# EasyEDA Pro project V2.0.epro, schematic Schematic
Board Name: V2.0; Create Date: 2024-12-31; Page Name: P1; Project Name: 【QuaX】QOpen RP-W5500; Schematic Name: Schematic; Update Date: 2025-03-01; Company: 嘉立创EDA; Drawed: ZRH; Page Size: A3; Version: V1.4
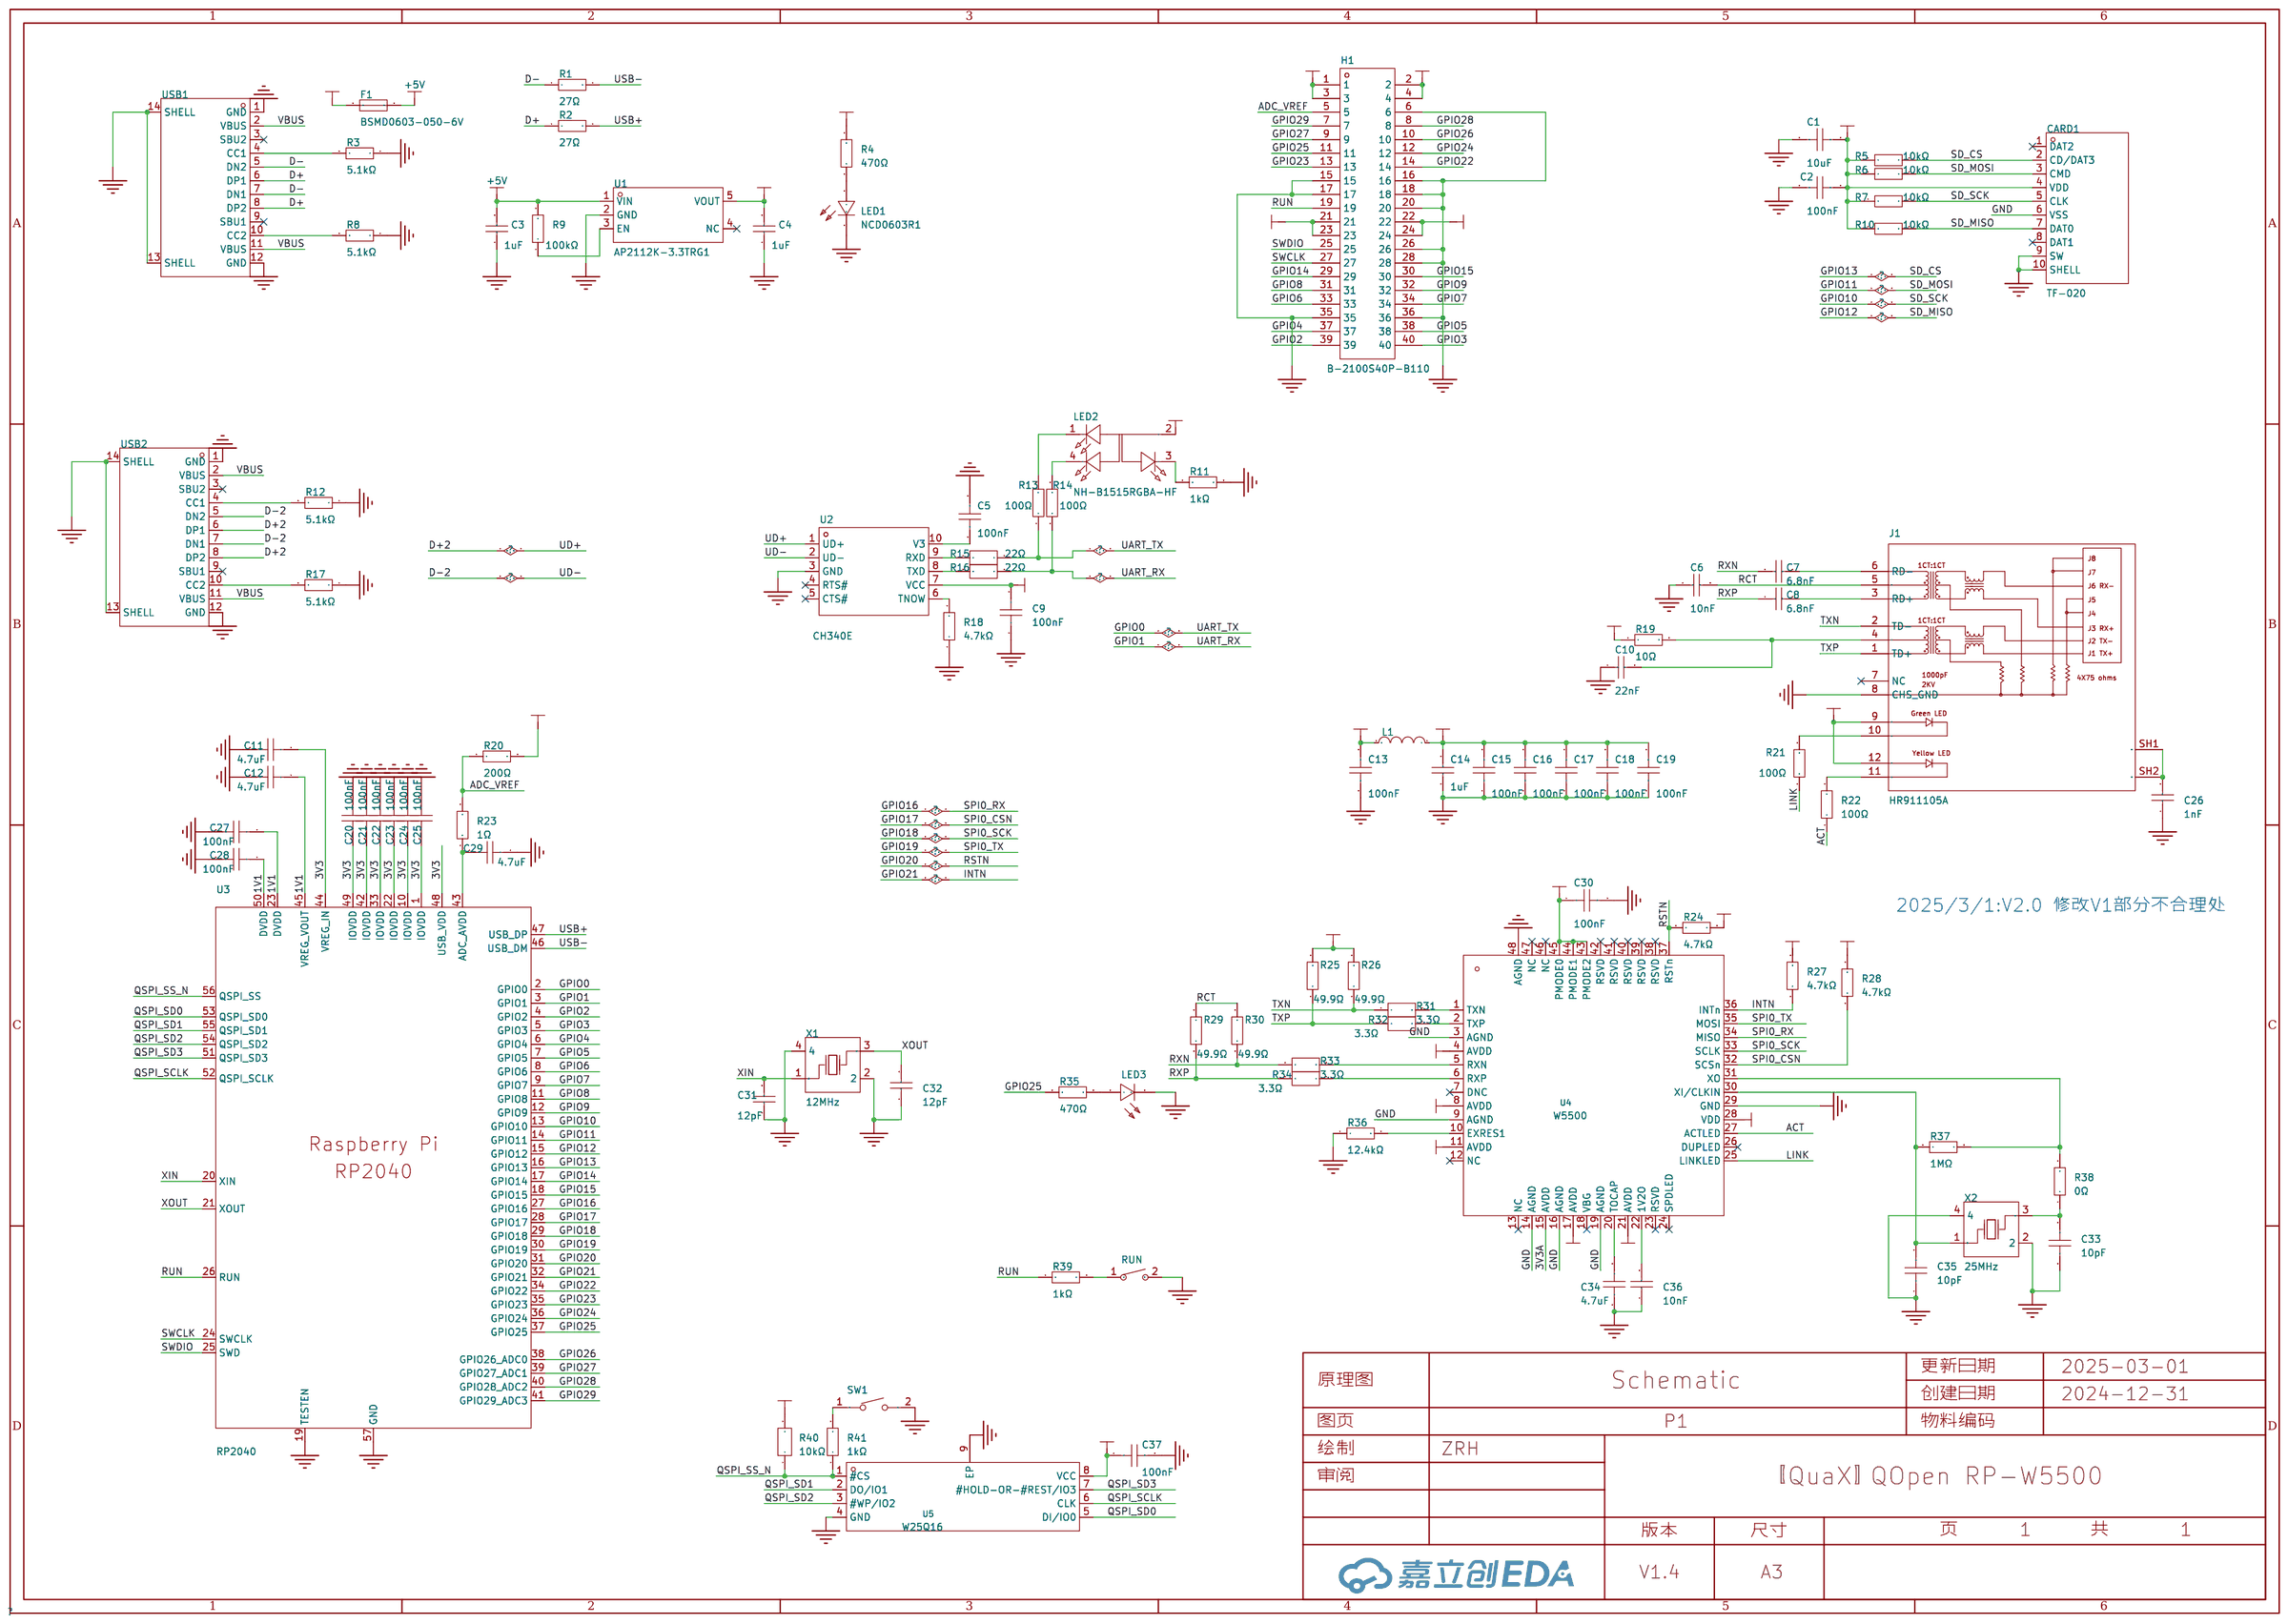
[diagram p0: schematic sheet]

## Parts
C1  10uF  [C0603]
C2  100nF  [C0603]
C3  1uF  [C0603]
C4  1uF  [C0603]
C5  100nF  [C0402]
C6  10nF  [C0402]
C7  6.8nF  [C0402]
C8  6.8nF  [C0402]
C9  100nF  [C0402]
C10  22nF  [C0402]
C11  4.7uF  [C0402]
C12  4.7uF  [C0402]
C13  100nF  [C0402]
C14  1uF  [C0603]
C15  100nF  [C0402]
C16  100nF  [C0402]
C17  100nF  [C0402]
C18  100nF  [C0402]
C19  100nF  [C0402]
C20  100nF  [C0402]
C21  100nF  [C0402]
C22  100nF  [C0402]
C23  100nF  [C0402]
C24  100nF  [C0402]
C25  100nF  [C0402]
C26  1nF  [C1206]
C27  100nF  [C0402]
C28  100nF  [C0402]
C29  4.7uF  [C0402]
C30  100nF  [C0402]
C31  12pF  [C0402]
C32  12pF  [C0402]
C33  10pF  [C0402]
C34  4.7uF  [C0402]
C35  10pF  [C0402]
C36  10nF  [C0402]
C37  100nF  [C0603]
CARD1  TF-020  [TF-SMD_TF-020]
F1  BSMD0603-050-6V  [F0603]
H1  B-2100S40P-B110  [HDR-TH_40P-P2.54-V-M-R2-C20-S2.54]
J1  HR911105A  [RJ45-TH_HR911105A]
L1  BLM18PG121SN1D  [L0603]
LED1  NCD0603R1  [LED0603-RD_RED]
LED2  NH-B1515RGBA-HF  [LED-ARRAY-SMD_4P-L1.6-W1.5-TL_NH-B1515RGBA]
LED3  NCD0603R1  [LED0603-RD_RED]
R1  27Ω  [R0402]
R2  27Ω  [R0402]
R3  5.1kΩ  [R0402]
R4  470Ω  [R0603]
R5  10kΩ  [R0603]
R6  10kΩ  [R0603]
R7  10kΩ  [R0603]
R8  5.1kΩ  [R0402]
R9  100kΩ  [R0603]
R10  10kΩ  [R0603]
R11  1kΩ  [R0402]
R12  5.1kΩ  [R0402]
R13  100Ω  [R0402]
R14  100Ω  [R0402]
R15  22Ω  [R0402]
R16  22Ω  [R0402]
R17  5.1kΩ  [R0402]
R18  4.7kΩ  [R0402]
R19  10Ω  [R0402]
R20  200Ω  [R0603]
R21  100Ω  [R0402]
R22  100Ω  [R0402]
R23  1Ω  [R0402]
R24  4.7kΩ  [R0402]
R25  49.9Ω  [R0402]
R26  49.9Ω  [R0402]
R27  4.7kΩ  [R0402]
R28  4.7kΩ  [R0402]
R29  49.9Ω  [R0402]
R30  49.9Ω  [R0402]
R31  3.3Ω  [R0402]
R32  3.3Ω  [R0402]
R33  3.3Ω  [R0402]
R34  3.3Ω  [R0402]
R35  470Ω  [R0603]
R36  12.4kΩ  [R0402]
R37  1MΩ  [R0402]
R38  0Ω  [R0402]
R39  1kΩ  [R0603]
R40  10kΩ  [R0603]
R41  1kΩ  [R0603]
RUN  TS-1071AD-A1B3-D4  [SW-SMD_L4.0-W3.0-LS4.8]
SW1  TS-1063S-B3D4  [KEY-SMD_L3.0-W2.5-LS4.0_TS-1603S]
U1  AP2112K-3.3TRG1  [SOT-25-5_L2.9-W1.6-P0.95-LS2.8-BL]
U2  CH340E  [MSOP-10_L3.0-W3.0-P0.50-LS5.0-BL]
U3  RP2040  [LQFN-56_L7.0-W7.0-P0.4-EP]
U4  W5500  [LQFP-48_L7.0-W7.0-P0.50-LS9.0-BL]
U5  W25Q16  [WSON-8_L6.0-W5.0-P1.27-BL-EP]
USB1  TYPE-C 16PIN 2MD(073)  [USB-C-SMD_TYPE-C-6PIN-2MD-073]
USB2  TYPE-C 16PIN 2MD(073)  [USB-C-SMD_TYPE-C-6PIN-2MD-073]
X1  12MHz  [OSC-SMD_4P-L2.5-W2.0-BL]
X2  25MHz  [CRYSTAL-SMD_4P-L2.5-W2.0-BL]

## Library data of the parts
C1 = CL10A106KP8NNNC: 容值:10uF;精度:±10%;额定电压:10V;材质(温度系数):X5R;; LCSC Part Name: 10uF ±10% 10V; Supplier Part: C19702; Manufacturer: SAMSUNG(三星); Supplier Footprint: 0603; Datasheet: https://atta.szlcsc.com/upload/public/pdf/source/20160218/1457707763339.pdf; Supplier: LCSC; Tolerance: ±10%; Voltage Rated: 10V; Temperature Coefficient: X5R
C2 C37 = CC0603KRX7R9BB104: 容值:100nF;精度:±10%;额定电压:50V;材质(温度系数):X7R;; LCSC Part Name: 100nF ±10% 50V; Supplier Part: C14663; Manufacturer: YAGEO(国巨); Supplier Footprint: 0603; Datasheet: https://atta.szlcsc.com/upload/public/pdf/source/20180910/C282072_33301C7F631E79921B82A8DAC6BCC5B3.pdf; Supplier: LCSC; Tolerance: ±10%; Voltage Rated: 50V; Temperature Coefficient: X7R
C3 C4 = CL10A105KB8NNNC: 容值:1uF;精度:±10%;额定电压:50V;材质(温度系数):X5R;; LCSC Part Name: 1uF ±10% 50V; Supplier Part: C15849; Manufacturer: SAMSUNG(三星); Supplier Footprint: 0603; Datasheet: https://atta.szlcsc.com/upload/public/pdf/source/20160218/1457707763339.pdf; Supplier: LCSC; Tolerance: ±10%; Voltage Rated: 50V; Temperature Coefficient: X5R
C5 C9 C13 C15-C19 C30 = CL05B104KB54PNC: 容值:100nF;精度:±10%;额定电压:50V;材质(温度系数):X7R;; LCSC Part Name: 100nF ±10% 50V; Supplier Part: C307331; Manufacturer: SAMSUNG(三星); Supplier Footprint: 0402; Datasheet: https://atta.szlcsc.com/upload/public/pdf/source/20181009/C307331_222F7C870FD3EA5F46F538B483443886.pdf; Supplier: LCSC; Tolerance: ±10%; Voltage Rated: 50V; Temperature Coefficient: X7R
C6 C36 = CC0402KRX7R9BB103: 容值:10nF;精度:±10%;额定电压:50V;材质(温度系数):X7R;; LCSC Part Name: 10nF ±10% 50V; Supplier Part: C60133; Manufacturer: YAGEO(国巨); Supplier Footprint: 0402; Datasheet: https://atta.szlcsc.com/upload/public/pdf/source/20180224/C181747_15194369449651363981.pdf; Supplier: LCSC; Tolerance: ±10%; Voltage Rated: 50V; Temperature Coefficient: X7R
C7 C8 = CC0402KRX7R9BB682: 容值:6.8nF;精度:±10%;额定电压:50V;材质(温度系数):X7R;; LCSC Part Name: 6.8nF ±10% 50V; Supplier Part: C93654; Manufacturer: YAGEO(国巨); Supplier Footprint: 0402; Datasheet: https://atta.szlcsc.com/upload/public/pdf/source/20181008/C309510_22F155564471FAF6A489F7D68F34234E.pdf; Supplier: LCSC; Tolerance: ±10%; Voltage Rated: 50V; Temperature Coefficient: X7R
C10 = CC0402KRX7R9BB223: 容值:22nF;精度:±10%;额定电压:50V;材质(温度系数):X7R;; LCSC Part Name: 22nF ±10% 50V; Supplier Part: C107026; Manufacturer: YAGEO(国巨); Supplier Footprint: 0402; Datasheet: https://atta.szlcsc.com/upload/public/pdf/source/20170914/C128857_1505359892143968080.pdf; Supplier: LCSC; Tolerance: ±10%; Voltage Rated: 50V; Temperature Coefficient: X7R
C11 C12 C29 = CL05A475KP5NRNC: 容值:4.7uF;精度:±10%;额定电压:10V;材质(温度系数):X5R;; LCSC Part Name: 4.7uF ±10% 10V; Supplier Part: C368809; Manufacturer: SAMSUNG(三星); Supplier Footprint: 0402; Datasheet: https://atta.szlcsc.com/upload/public/pdf/source/20160218/1457707763339.pdf; Supplier: LCSC; Tolerance: ±10%; Voltage Rated: 10V; Temperature Coefficient: X5R
C14 = 0603B105K250NT: 容值:1uF;精度:±10%;额定电压:25V;材质(温度系数):X7R;; LCSC Part Name: 1uF ±10% 25V; Supplier Part: C59302; Manufacturer: FH(风华); Supplier Footprint: 0603; Datasheet: https://atta.szlcsc.com/upload/public/pdf/source/20200305/C486355_26A10D38EF8C2A5C37091D0039909270.pdf; Supplier: LCSC; Tolerance: ±10%; Voltage Rated: 25V; Temperature Coefficient: X7R
C20-C25 C27 C28 = CC0402KRX7R7BB104: 容值:100nF;精度:±10%;额定电压:16V;材质(温度系数):X7R;; LCSC Part Name: 100nF ±10% 16V; Supplier Part: C60474; Manufacturer: YAGEO(国巨); Supplier Footprint: 0402; Datasheet: https://atta.szlcsc.com/upload/public/pdf/source/20211223/9278FD768280B81DDBEF48FA36411A03.pdf; Supplier: LCSC; Tolerance: ±10%; Voltage Rated: 16V; Temperature Coefficient: X7R
C26 = 1206B102K202NT: 容值:1nF;精度:±10%;额定电压:2kV;材质(温度系数):X7R;; LCSC Part Name: 1nF ±10% 2kV; Supplier Part: C9196; Manufacturer: FH(风华); Supplier Footprint: 1206; Datasheet: https://atta.szlcsc.com/upload/public/pdf/source/20200305/C486355_26A10D38EF8C2A5C37091D0039909270.pdf; Supplier: LCSC; Tolerance: ±10%; Voltage Rated: 2kV; Temperature Coefficient: X7R
C31 C32 = 0402CG120J500NT: 容值:12pF;精度:±5%;额定电压:50V;材质(温度系数):C0G;; LCSC Part Name: 12pF ±5% 50V; Supplier Part: C1547; Manufacturer: FH(风华); Supplier Footprint: 0402; Datasheet: https://atta.szlcsc.com/upload/public/pdf/source/20200305/C486355_26A10D38EF8C2A5C37091D0039909270.pdf; Supplier: LCSC; Tolerance: ±5%; Voltage Rated: 50V; Temperature Coefficient: C0G
C33 C35 = CL05C100JB5NNNC: 容值:10pF;精度:±5%;额定电压:50V;材质(温度系数):C0G;; LCSC Part Name: 10pF ±5% 50V; Supplier Part: C32949; Manufacturer: SAMSUNG(三星); Supplier Footprint: 0402; JLCPCB Part Class: 基础库; Datasheet: https://atta.szlcsc.com/upload/public/pdf/source/20160218/1457707763339.pdf; Supplier: LCSC; Tolerance: ±5%; Voltage Rated: 50V; Temperature Coefficient: C0G
C34 = GRM155R61E475ME15D: 容值:4.7uF;额定电压:25V;材质(温度系数):X5R;; LCSC Part Name: 4.7uF 25V; Supplier Part: C2858031; Manufacturer: muRata(村田); Supplier Footprint: 0402; Datasheet: https://atta.szlcsc.com/upload/public/pdf/source/20170523/1495533985505.pdf; Supplier: LCSC; Voltage Rated: 25V; Temperature Coefficient: X5R
CARD1 = TF-020: 卡连接方式:拔插式;卡类型:MicroSD卡(TF卡);连接器类型:卡座;本体最大高度:1.32mm;触头镀层:镀金;工作温度范围:-45℃~+85℃;; LCSC Part Name: 拔插式 MicroSD卡(TF卡) 卡座; Supplier Part: C961681; Manufacturer: HANBO(汉博); Supplier Footprint: SMD; JLCPCB Part Class: 扩展库; Datasheet: https://atta.szlcsc.com/upload/public/pdf/source/20221111/8B0ADC00F0C3F54A097DF36EFC4442FF.pdf; Supplier: LCSC; Card Connection Mode: 拔插式; Card Type: MicroSD卡(TF卡); Connector Type: 卡座; Maximum Body Height: 1.32mm; Contact Plating: 镀金; Operating Temperature Range: -45℃~+85℃
F1 = BSMD0603-050-6V: 最大电压:6V;最大电流:40A;保持电流:500mA;跳闸电流:1A;; LCSC Part Name: 6V 500mA 0603自恢复; Supplier Part: C883095; Manufacturer: BHFUSE(佰宏); Supplier Footprint: 0603; Datasheet: https://atta.szlcsc.com/upload/public/pdf/source/20230512/E478DE3555A0061DA0124A9F45802B86.pdf; Supplier: LCSC; Operating Voltage (Max): 6V; Current Rating (Max): 40A; Hold Current: 500mA; Trip Current: 1A; Power Dissipation: 500mW; Resistance - Initial (Ri) (Min): 100mΩ; Resistance - Post Trip (R1) (Max): 800mΩ; Maximum Time to Trip: 100ms; Operating Temperature: -40℃~+85℃
H1 = B-2100S40P-B110: 插针结构:2x20P;间距:2.54mm;行距:2.54mm;圆针/方针:-;安装类型:直插;排数:双排;总PIN位数:40P;额定电流:-;额定电压:-;配合针长度:6mm;塑高:2.54mm;端接针长度:3mm;触头材质:黄铜;触头镀层:-;工作温度范围:-40℃~+105℃;颜色:黑色;; LCSC Part Name: 间距:2.54mm 2x20P 直插; Supplier Part: C124383; Manufacturer: Ckmtw(灿科盟); Supplier Footprint: 插件,P=2.54mm; JLCPCB Part Class: 扩展库; Datasheet: https://atta.szlcsc.com/upload/public/pdf/source/20180130/C169817_15172974075481323419.pdf; Supplier: LCSC; Pin Structure: 2x20P; Pitch: 2.54mm; Row Spacing: 2.54mm; Mounting Type: 直插; Number of Rows: 双排; Number of Pins: 40P; Length of Mating Pin: 6mm; Insulation Height: 2.54mm; Length of End Connection Pin: 3mm; Contact Material: 黄铜; Operating Temperature Range: -40℃~+105℃; Color: 黑色
J1 = HR911105A_C12074: 连接器类型:RJ插座;USOC代码:RJ45;端口数量:1;屏蔽:-;LED:带LED;等级:-;; LCSC Part Name: RJ45 带LED; Supplier Part: C12074; Manufacturer: HANRUN(汉仁); Supplier Footprint: 插件; Datasheet: https://atta.szlcsc.com/upload/public/pdf/source/20170918/C12074_1505726819496976146.pdf; Supplier: LCSC; Connector Type: RJ插座; USOC Codes: RJ45; Number of Ports: 1; LED: 带LED
L1 = BLM18PG121SN1D: 标称阻抗@测试频率:120Ω@100MHz;误差:±25%;直流电阻(RDC):50mΩ;; LCSC Part Name: 单路 0603磁珠 阻抗120Ω@100MHz; Supplier Part: C14709; Manufacturer: muRata(村田); Supplier Footprint: 0603; JLCPCB Part Class: 扩展库; Datasheet: https://atta.szlcsc.com/upload/public/pdf/source/20130704/1457706621422.pdf; Supplier: LCSC; Impedance @ Frequency: 120Ω@100MHz; Tolerance: ±25%; DC Resistance: 50mΩ; Current Rating: 2A; Circuits: 1
LED1 LED3 = NCD0603R1_C84263: 灯头类型:-;发光颜色:红色;正向电压(VF):1.6V~2.6V;功率:65mW;正向电流:20mA;主波长:615nm~630nm;二极管配置:独立二极管;透镜颜色:无色透明透镜;色温:-;发光强度:80mcd~220mcd;发光角度:130°;载带方式:-;工作温度:-30℃~+85℃;; Supplier Part: C84263; Manufacturer: 国星光电; Supplier Footprint: 0603; Datasheet: https://atta.szlcsc.com/upload/public/pdf/source/20200820/C84263_DABC6A75E58F576973B407FDBA283D60.pdf; Supplier: LCSC; Emitted Color: 红色; Forward Voltage (VF): 1.6V~2.6V; Power Dissipation: 65mW; Forward Current: 20mA; Dominant Wavelength: 615nm~630nm; Diode Configuration: 独立二极管; Lens Color: 无色透明透镜; Luminous Intensity: 80mcd~220mcd; Viewing Angle: 130°; Operating Temperature: -30℃~+85℃
LED2 = NH-B1515RGBA-HF: 发光颜色:RGB三色;正向电压(VF):2.7V；2V；2.8V;功率:64mW；48mW;正向电流:3mA；8mA；5mA;主波长:470nm；526nm；622nm;二极管配置:共阳极;透镜颜色:-;色温:-;发光强度:155mcd；25mcd；48mcd;发光角度:110°;载带方式:-;工作温度:-30℃~+85℃;; Supplier Part: C2874115; Manufacturer: 国星光电; Supplier Footprint: 0606; Datasheet: https://atta.szlcsc.com/upload/public/pdf/source/20210810/0C11C8EE97F43D8CD153FEF2CA3E0D70.pdf; Supplier: LCSC; Emitted Color: RGB三色; Forward Voltage (VF): 2.7V；2V；2.8V; Power Dissipation: 64mW；48mW; Forward Current: 3mA；8mA；5mA; Dominant Wavelength: 470nm；526nm；622nm; Diode Configuration: 共阳极; Luminous Intensity: 155mcd；25mcd；48mcd; Viewing Angle: 110°; Operating Temperature: -30℃~+85℃
R1 R2 = RC0402FR-0727RL: 电阻类型:厚膜电阻;阻值:27Ω;精度:±1%;功率:62.5mW;最大工作电压:50V;温度系数:±100ppm/℃;; LCSC Part Name: 厚膜电阻 27Ω ±1% 62.5mW; Supplier Part: C138021; Manufacturer: YAGEO(国巨); Supplier Footprint: 0402; JLCPCB Part Class: 扩展库; Datasheet: https://atta.szlcsc.com/upload/public/pdf/source/20181009/C309620_DA5935B6E1D48212CB7A533FE518B3C2.pdf; Supplier: LCSC; Type: 厚膜电阻; Tolerance: ±1%; Power(Watts): 62.5mW; Overload Voltage (Max): 50V; Temperature Coefficient: ±100ppm/℃; Operating Temperature Range: -55℃~+155℃
R3 R8 R12 R17 = 0402WGF5101TCE: 电阻类型:厚膜电阻;阻值:5.1kΩ;精度:±1%;功率:62.5mW;最大工作电压:50V;温度系数:±100ppm/℃;; LCSC Part Name: 5.1kΩ ±1% 62.5mW 厚膜电阻; Supplier Part: C25905; Manufacturer: UNI-ROYAL(厚声); Supplier Footprint: 0402; Datasheet: https://atta.szlcsc.com/upload/public/pdf/source/20200306/C422600_1E6D84923E4A46A82E41ADD87F860B5C.pdf; Supplier: LCSC; Type: 厚膜电阻; Tolerance: ±1%; Power(Watts): 62.5mW; Overload Voltage (Max): 50V; Temperature Coefficient: ±100ppm/℃; Operating Temperature Range: -55℃~+155℃
R4 = 0603WAF4700T5E: 电阻类型:厚膜电阻;阻值:470Ω;精度:±1%;功率:100mW;最大工作电压:75V;温度系数:±100ppm/℃;; LCSC Part Name: 470Ω ±1% 100mW 厚膜电阻; Supplier Part: C23179; Manufacturer: UNI-ROYAL(厚声); Supplier Footprint: 0603; Datasheet: https://atta.szlcsc.com/upload/public/pdf/source/20200306/C422600_1E6D84923E4A46A82E41ADD87F860B5C.pdf; Supplier: LCSC; Type: 厚膜电阻; Tolerance: ±1%; Power(Watts): 100mW; Overload Voltage (Max): 75V; Temperature Coefficient: ±100ppm/℃; Operating Temperature Range: -55℃~+155℃
R5-R7 R10 = 0603WAF1002T5E: 电阻类型:厚膜电阻;阻值:10kΩ;精度:±1%;功率:100mW;最大工作电压:75V;温度系数:±100ppm/℃;; LCSC Part Name: 厚膜电阻 10kΩ ±1% 100mW; Supplier Part: C25804; Manufacturer: UNI-ROYAL(厚声); Supplier Footprint: 0603; Datasheet: https://atta.szlcsc.com/upload/public/pdf/source/20200306/C422600_1E6D84923E4A46A82E41ADD87F860B5C.pdf; Supplier: LCSC; Type: 厚膜电阻; Tolerance: ±1%; Power(Watts): 100mW; Overload Voltage (Max): 75V; Temperature Coefficient: ±100ppm/℃; Operating Temperature Range: -55℃~+155℃
R9 = RC0603FR-07100KL: 电阻类型:厚膜电阻;阻值:100kΩ;精度:±1%;功率:100mW;最大工作电压:75V;温度系数:±100ppm/℃;; LCSC Part Name: 厚膜电阻 100kΩ ±1% 100mW; Supplier Part: C14675; Manufacturer: YAGEO(国巨); Supplier Footprint: 0603; Datasheet: https://atta.szlcsc.com/upload/public/pdf/source/20140324/1457707028752.pdf; Supplier: LCSC; Type: 厚膜电阻; Tolerance: ±1%; Power(Watts): 100mW; Overload Voltage (Max): 75V; Temperature Coefficient: ±100ppm/℃; Operating Temperature Range: -55℃~+155℃
R11 = ERJ2RKF1001X: 阻值:1kΩ;精度:±1%;功率:100mW;温度系数:±100ppm/℃;电阻类型:厚膜电阻;; LCSC Part Name: 1kΩ ±1% 100mW 厚膜电阻; Supplier Part: C242161; Manufacturer: PANASONIC(松下); Supplier Footprint: 0402; Datasheet: https://atta.szlcsc.com/upload/public/pdf/source/20181106/C242161_4F5F550A2C91B7234698FE1AE4119762.pdf; Supplier: LCSC; Tolerance: ±1%; Power(Watts): 100mW; Temperature Coefficient: ±100ppm/℃; Type: 厚膜电阻; Operating Temperature Range: -55℃~+155℃
R13 R14 = RC0402FR-07100RL: 电阻类型:厚膜电阻;阻值:100Ω;精度:±1%;功率:62.5mW;; LCSC Part Name: 100Ω ±1% 62.5mW; Supplier Part: C106232; Manufacturer: YAGEO(国巨); Supplier Footprint: 0402; Datasheet: https://atta.szlcsc.com/upload/public/pdf/source/20170518/1495085712869.pdf; Supplier: LCSC; Type: 厚膜电阻; Tolerance: ±1%; Power(Watts): 62.5mW; Temperature Coefficient: ±100ppm/℃; Overload Voltage (Max): 50V; Operating Temperature Range: -55℃~+155℃
R15 R16 = ERJ2RKF22R0X: 阻值:22Ω;精度:±1%;功率:100mW;温度系数:±100ppm/℃;电阻类型:厚膜电阻;; LCSC Part Name: 22Ω ±1% 100mW 厚膜电阻; Supplier Part: C413049; Manufacturer: PANASONIC(松下); Supplier Footprint: 0402; Datasheet: https://atta.szlcsc.com/upload/public/pdf/source/20190820/C413049_961C628CF7B0DFFBC596BB178EBFA00C.pdf; Supplier: LCSC; Tolerance: ±1%; Power(Watts): 100mW; Temperature Coefficient: ±100ppm/℃; Type: 厚膜电阻; Operating Temperature Range: -55℃~+155℃
R18 R24 R27 R28 = 0402WGF4701TCE: 阻值:4.7kΩ;精度:±1%;功率:62.5mW;温度系数:±100ppm/℃;电阻类型:厚膜电阻;; LCSC Part Name: 4.7kΩ ±1% 62.5mW 厚膜电阻; Supplier Part: C25900; Manufacturer: UNI-ROYAL(厚声); Supplier Footprint: 0402; Datasheet: https://atta.szlcsc.com/upload/public/pdf/source/20200306/C422600_1E6D84923E4A46A82E41ADD87F860B5C.pdf; Supplier: LCSC; Tolerance: ±1%; Power(Watts): 62.5mW; Overload Voltage (Max): 50V; Temperature Coefficient: ±100ppm/℃; Type: 厚膜电阻; Operating Temperature Range: -55℃~+155℃
R19 = 0402WGF100JTCE: 电阻类型:厚膜电阻;阻值:10Ω;精度:±1%;功率:62.5mW;最大工作电压:50V;温度系数:±200ppm/℃;; LCSC Part Name: 10Ω ±1% 62.5mW 厚膜电阻; Supplier Part: C25077; Manufacturer: UNI-ROYAL(厚声); Supplier Footprint: 0402; Datasheet: https://atta.szlcsc.com/upload/public/pdf/source/20200306/C422600_1E6D84923E4A46A82E41ADD87F860B5C.pdf; Supplier: LCSC; Type: 厚膜电阻; Tolerance: ±1%; Power(Watts): 62.5mW; Overload Voltage (Max): 50V; Temperature Coefficient: ±200ppm/℃; Operating Temperature Range: -55℃~+155℃
R20 = 0603WAF2000T5E: 电阻类型:厚膜电阻;阻值:200Ω;精度:±1%;功率:100mW;最大工作电压:75V;温度系数:±100ppm/℃;; LCSC Part Name: 200Ω ±1% 100mW 厚膜电阻; Supplier Part: C8218; Manufacturer: UNI-ROYAL(厚声); Supplier Footprint: 0603; Datasheet: https://atta.szlcsc.com/upload/public/pdf/source/20200306/C422600_1E6D84923E4A46A82E41ADD87F860B5C.pdf; Supplier: LCSC; Type: 厚膜电阻; Tolerance: ±1%; Power(Watts): 100mW; Overload Voltage (Max): 75V; Temperature Coefficient: ±100ppm/℃; Operating Temperature Range: -55℃~+155℃
R21 R22 = 0402WGF1000TCE: 电阻类型:厚膜电阻;阻值:100Ω;精度:±1%;功率:62.5mW;最大工作电压:50V;温度系数:±200ppm/℃;; LCSC Part Name: 100Ω ±1% 62.5mW 厚膜电阻; Supplier Part: C25076; Manufacturer: UNI-ROYAL(厚声); Supplier Footprint: 0402; Datasheet: https://atta.szlcsc.com/upload/public/pdf/source/20200306/C422600_1E6D84923E4A46A82E41ADD87F860B5C.pdf; Supplier: LCSC; Type: 厚膜电阻; Tolerance: ±1%; Power(Watts): 62.5mW; Overload Voltage (Max): 50V; Temperature Coefficient: ±200ppm/℃; Operating Temperature Range: -55℃~+155℃
R23 = 0402WGF100KTCE: 电阻类型:厚膜电阻;阻值:1Ω;精度:±1%;功率:62.5mW;最大工作电压:50V;温度系数:±200ppm/℃;; LCSC Part Name: 1Ω ±1% 62.5mW 厚膜电阻; Supplier Part: C25086; Manufacturer: UNI-ROYAL(厚声); Supplier Footprint: 0402; Datasheet: https://atta.szlcsc.com/upload/public/pdf/source/20200306/C422600_1E6D84923E4A46A82E41ADD87F860B5C.pdf; Supplier: LCSC; Type: 厚膜电阻; Tolerance: ±1%; Power(Watts): 62.5mW; Overload Voltage (Max): 50V; Temperature Coefficient: ±200ppm/℃; Operating Temperature Range: -55℃~+155℃
R25 R26 R29 R30 = 0402WGF499JTCE: 电阻类型:厚膜电阻;阻值:49.9Ω;精度:±1%;功率:62.5mW;最大工作电压:50V;温度系数:±100ppm/℃;; LCSC Part Name: 49.9Ω ±1% 62.5mW 厚膜电阻; Supplier Part: C25120; Manufacturer: UNI-ROYAL(厚声); Supplier Footprint: 0402; JLCPCB Part Class: 基础库; Datasheet: https://atta.szlcsc.com/upload/public/pdf/source/20200306/C422600_1E6D84923E4A46A82E41ADD87F860B5C.pdf; Supplier: LCSC; Type: 厚膜电阻; Tolerance: ±1%; Power(Watts): 62.5mW; Overload Voltage (Max): 50V; Temperature Coefficient: ±100ppm/℃; Operating Temperature Range: -55℃~+155℃
R31-R34 = FRC0402F3R30TS: 电阻类型:厚膜电阻;阻值:3.3Ω;精度:±1%;功率:62.5mW;最大工作电压:50V;温度系数:±200ppm/℃;; LCSC Part Name: 3.3Ω ±1% 62.5mW 厚膜电阻; Supplier Part: C2933094; Manufacturer: FOJAN(富捷); Supplier Footprint: 0402; Datasheet: https://atta.szlcsc.com/upload/public/pdf/source/20211221/925EC7D7225764EE0046F22065062C87.pdf; Supplier: LCSC; Type: 厚膜电阻; Tolerance: ±1%; Power(Watts): 62.5mW; Overload Voltage (Max): 50V; Temperature Coefficient: ±200ppm/℃; Operating Temperature Range: -55℃~+155℃
R35 = 0603WAF1501T5E: 电阻类型:厚膜电阻;阻值:1.5kΩ;精度:±1%;功率:100mW;最大工作电压:75V;温度系数:±100ppm/℃;; LCSC Part Name: 1.5kΩ ±1% 100mW 厚膜电阻; Supplier Part: C22843; Manufacturer: UNI-ROYAL(厚声); Supplier Footprint: 0603; Datasheet: https://atta.szlcsc.com/upload/public/pdf/source/20200306/C422600_1E6D84923E4A46A82E41ADD87F860B5C.pdf; Supplier: LCSC; Type: 厚膜电阻; Tolerance: ±1%; Power(Watts): 100mW; Overload Voltage (Max): 75V; Temperature Coefficient: ±100ppm/℃; Operating Temperature Range: -55℃~+155℃
R36 = 0402WGF1242TCE: 电阻类型:厚膜电阻;阻值:12.4kΩ;精度:±1%;功率:62.5mW;最大工作电压:50V;温度系数:±100ppm/℃;; LCSC Part Name: 12.4kΩ ±1% 62.5mW 厚膜电阻; Supplier Part: C11692; Manufacturer: UNI-ROYAL(厚声); Supplier Footprint: 0402; Datasheet: https://atta.szlcsc.com/upload/public/pdf/source/20200306/C422600_1E6D84923E4A46A82E41ADD87F860B5C.pdf; Supplier: LCSC; Type: 厚膜电阻; Tolerance: ±1%; Power(Watts): 62.5mW; Overload Voltage (Max): 50V; Temperature Coefficient: ±100ppm/℃; Operating Temperature Range: -55℃~+155℃
R37 = 0402WGF1004TCE: 电阻类型:厚膜电阻;阻值:1MΩ;精度:±1%;功率:62.5mW;最大工作电压:50V;温度系数:±100ppm/℃;; LCSC Part Name: 1MΩ ±1% 62.5mW 厚膜电阻; Supplier Part: C26083; Manufacturer: UNI-ROYAL(厚声); Supplier Footprint: 0402; Datasheet: https://atta.szlcsc.com/upload/public/pdf/source/20200306/C422600_1E6D84923E4A46A82E41ADD87F860B5C.pdf; Supplier: LCSC; Type: 厚膜电阻; Tolerance: ±1%; Power(Watts): 62.5mW; Overload Voltage (Max): 50V; Temperature Coefficient: ±100ppm/℃; Operating Temperature Range: -55℃~+155℃
R38 = 0402WGF0000TCE: 电阻类型:厚膜电阻;阻值:0Ω;精度:±1%;功率:62.5mW;最大工作电压:50V;温度系数:±800ppm/℃;; LCSC Part Name: 0Ω ±1% 62.5mW 厚膜电阻; Supplier Part: C17168; Manufacturer: UNI-ROYAL(厚声); Supplier Footprint: 0402; Datasheet: https://atta.szlcsc.com/upload/public/pdf/source/20200306/C422600_1E6D84923E4A46A82E41ADD87F860B5C.pdf; Supplier: LCSC; Type: 厚膜电阻; Tolerance: ±1%; Power(Watts): 62.5mW; Overload Voltage (Max): 50V; Temperature Coefficient: ±800ppm/℃; Operating Temperature Range: -55℃~+155℃
R39 R41 = RC0603FR-071KL: 电阻类型:厚膜电阻;阻值:1kΩ;精度:±1%;功率:100mW;最大工作电压:75V;温度系数:±100ppm/℃;; LCSC Part Name: 厚膜电阻 1kΩ ±1% 100mW; Supplier Part: C22548; Manufacturer: YAGEO(国巨); Supplier Footprint: 0603; Datasheet: https://atta.szlcsc.com/upload/public/pdf/source/20180316/70C0E2BDAE7FCC62C531A5A58D202EE1.pdf; Supplier: LCSC; Type: 厚膜电阻; Tolerance: ±1%; Power(Watts): 100mW; Overload Voltage (Max): 75V; Temperature Coefficient: ±100ppm/℃; Operating Temperature Range: -55℃~+155℃
R40 = FRC0603J103TS: 电阻类型:厚膜电阻;阻值:10kΩ;精度:±5%;功率:100mW;最大工作电压:75V;温度系数:±100ppm/℃;; LCSC Part Name: 10kΩ ±5% 100mW 厚膜电阻; Supplier Part: C2930027; Manufacturer: FOJAN(富捷); Supplier Footprint: 0603; Datasheet: https://atta.szlcsc.com/upload/public/pdf/source/20211221/925EC7D7225764EE0046F22065062C87.pdf; Supplier: LCSC; Type: 厚膜电阻; Tolerance: ±5%; Power(Watts): 100mW; Overload Voltage (Max): 75V; Temperature Coefficient: ±100ppm/℃; Operating Temperature Range: -55℃~+155℃
RUN = TS-1071AD-A1B3-D4: 电路结构:单刀单掷;按钮形状:圆形按钮;作用力:250gf;安装方式:-;开关长度:4mm;开关宽度:3mm;开关高度:2mm;带灯:-;机械寿命:-;; LCSC Part Name: 轻触开关4.0*3.0*2两脚贴片无柱小龟250gf; Supplier Part: C492878; Manufacturer: Yuandi(元迪); Datasheet: https://atta.szlcsc.com/upload/public/pdf/source/20200316/C492878_F665FC46291D1CEBBF5F4DDB4422506A.pdf; Supplier: LCSC; Circuit: 单刀单掷; Actuator Style: 圆形按钮; Operating Force: 250gf; Switch Length: 4mm; Switch Width: 3mm; Switch Height: 2mm
SW1 = TS-1063S-B3D4: 电路结构:单刀单掷;按钮形状:矩形按钮;作用力:250gf;安装方式:-;带灯:-;机械寿命:-;; LCSC Part Name: 轻触开关3.0*2.5侧按贴片带柱小小龟250gf; Supplier Part: C498291; Manufacturer: Yuandi(元迪); Datasheet: https://atta.szlcsc.com/upload/public/pdf/source/20200318/C498291_A3607BD92317BA61A63F6AFAF35A0DD0.pdf; Supplier: LCSC; Circuit: 单刀单掷; Actuator Style: 矩形按钮; Operating Force: 250gf
U1 = AP2112K-3.3TRG1: 输出类型:固定;最大输入电压:6V;输出电压:3.3V;最大输出电流:600mA;电源纹波抑制比(PSRR):65dB@(100Hz,1kHz);输出极性:正极;; LCSC Part Name: 输入6V 输出3.3V 600mA; Supplier Part: C51118; Manufacturer: DIODES(美台); Supplier Footprint: SOT-25-5; Datasheet: https://atta.szlcsc.com/upload/public/pdf/source/20171221/C51118_15138312998391195590.pdf; Supplier: LCSC; Output Type: 固定; Maximum Input Voltage: 6V; Output Voltage: 3.3V; MAX Output Current: 600mA; Power Supply Rejection Ratio (PSRR): 65dB@(100Hz,1kHz); Dropout Voltage: 400mV@(600mA); standby current: 80uA; Operating Temperature: -40℃~+85℃; Output Polarity: 正极; Number of Outputs: 1
U2 = CH340E: 应用功能:收发器;接口协议:USB 2.0;数据速率:2Mbps;; LCSC Part Name: USB转串口芯片 CH340; Supplier Part: C99652; Manufacturer: WCH(南京沁恒); Supplier Footprint: MSOP-10; JLCPCB Part Class: 扩展库; Datasheet: https://atta.szlcsc.com/upload/public/pdf/source/20230530/6E401E9554E9F5311886CC8B3F89B62E.pdf; Supplier: LCSC; Applications Function: 收发器; Protocol: USB 2.0; Data Rate: 2Mbps; Supply Voltage: 3.3V；5V
U3 = RP2040_C2040: CPU内核:-;RAM总容量:264KB;GPIO端口数量:30;工作电压范围:-;CPU最大主频:133MHz;程序存储器类型:-;应用领域:-;; LCSC Part Name: RP2040（RP2B2）; Supplier Part: C2040; Manufacturer: Raspberry Pi(树莓派); Supplier Footprint: LQFN-56(7x7); Datasheet: https://atta.szlcsc.com/upload/public/pdf/source/20210621/C2040_96F425825606B7957D87DD32E2512CA9.pdf; Supplier: LCSC; RAM Size: 264KB; GPIO Ports Number: 30; CPU Maximum Speed: 133MHz; ADC (Bit): 12bit; UART/USART: 2; I2C: 2; SPI: 2; Universal Serial Bus: 有; Peripheral/Function: DMA；PWM; Direct Memory Access: 有
U4 = W5500: 应用功能:控制器;通道数:-;接口类型:SPI;; LCSC Part Name: 硬连线TCP/IP嵌入式以太网控制器; Supplier Part: C32843; Manufacturer: WIZNET; Supplier Footprint: LQFP-48(7x7); Datasheet: https://atta.szlcsc.com/upload/public/pdf/source/20230714/E10C32B058E0BA54FCE1C1556BE10C07.pdf; Supplier: LCSC; Application Function: 控制器; Interface: SPI; Supply Voltage: 2.97V~3.63V; Supply Current: 132mA; Operating Temperature: -40℃~+85℃
U5 = W25Q128JVPIQ_C190862: 存储容量:16Mbit;; LCSC Part Name: W25Q128JVPIQ; Supplier Part: C190862; Manufacturer: WINBOND(华邦); Supplier Footprint: WSON-8-EP(5x6); Datasheet: https://atta.szlcsc.com/upload/public/pdf/source/20190705/C401662_06B6D416F67ED315879B366F63A3F7C9.pdf; Supplier: LCSC; Memory Size: 16Mbit
USB1 USB2 = TYPE-C 16PIN 2MD(073): 连接器类型:Type-C;标准:-;公母:母;端口数量:1;触点数量:16P;安装方式:卧贴;额定电流 - 电源:5A;工作温度范围:-25℃~+85℃;; LCSC Part Name: Type-C 母 卧贴; Supplier Part: C2765186; Manufacturer: SHOU HAN(首韩); Supplier Footprint: SMD; JLCPCB Part Class: 扩展库; Datasheet: https://atta.szlcsc.com/upload/public/pdf/source/20211123/39B17C16241EAC15C5E277BDA434118E.pdf; Supplier: LCSC; Connector Type: Type-C; Gender: 母; Number of Ports: 1; Number of Contacts: 16P; Mounting Style: 卧贴; Current Rating - Power (Max): 5A; Operating Temperature Range: -25℃~+85℃
X1 = TXM12M0004252FBCEO00T: 晶振类型:贴片晶振;频率:12MHz;常温频差:±10ppm;外接负载电容:12pF;频率稳定度(全温):±30ppm;; LCSC Part Name: 12MHz ±10ppm 12pF; Supplier Part: C284155; Manufacturer: YJX(雅晶鑫); Supplier Footprint: SMD2520-4P; Datasheet: https://atta.szlcsc.com/upload/public/pdf/source/20180910/C284155_B9AC3CB548367C19CE747B551130DB15.pdf; Supplier: LCSC; Crystal Type: 贴片晶振; Normal temperature Frequency Tolerance: ±10ppm; External load capacitor: 12pF; Frequency Stability(Full temperature range): ±30ppm; Equivalent Series Resistance (ESR): 120Ω; Operating Temperature: -40℃~+85℃
X2 = TXM25M0004252DBCEO00T: 晶振类型:贴片晶振;频率:25MHz;常温频差:±10ppm;外接负载电容:10pF;频率稳定度(全温):±30ppm;; LCSC Part Name: 25MHz ±10ppm 10pF; Supplier Part: C284164; Manufacturer: YJX(雅晶鑫); Supplier Footprint: SMD2520-4P; JLCPCB Part Class: 扩展库; Datasheet: https://atta.szlcsc.com/upload/public/pdf/source/20180910/C284164_C8AFD57C0B4FDB088C695DDAB8DB8FFB.pdf; Supplier: LCSC; Crystal Type: 贴片晶振; Normal temperature Frequency Tolerance: ±10ppm; External load capacitor: 10pF; Frequency Stability(Full temperature range): ±30ppm; Equivalent Series Resistance (ESR): 45Ω; Operating Temperature: -40℃~+85℃

## Nets
1V1: C12.1 C27.1 C28.1 U3.23(DVDD) U3.45(VREG_VOUT) U3.50(DVDD)
3V3: C1.2 C2.2 C4.2 C9.2 C11.1 C13.2 C20.1 C21.1 C22.1 C23.1 C24.1 C25.1 C30.1 C37.1 CARD1.4(VDD) H1.21 H1.22 H1.23 H1.24 J1.9 J1.12 L1.2 LED2.2(+) R4.2 R5.1 R6.1 R7.1 R10.1 R20.2 R24.2 R27.2 R28.2 R40.2 U1.5(VOUT) U2.7(VCC) U3.1(IOVDD) U3.10(IOVDD) U3.22(IOVDD) U3.33(IOVDD) U3.42(IOVDD) U3.44(VREG_IN) U3.48(USB_VDD) U3.49(IOVDD) U4.28(VDD) U4.43(PMODE2) U4.44(PMODE1) U4.45(PMODE0) U5.8(VCC)
3V3A: C14.2 C15.2 C16.2 C17.2 C18.2 C19.2 L1.1 R19.1 R25.2 R26.2 U4.4(AVDD) U4.8(AVDD) U4.11(AVDD) U4.15(AVDD) U4.17(AVDD) U4.21(AVDD)
+5V: C3.2 F1.2 R9.2 U1.1(VIN)
GND: C1.1 C2.1 C3.1 C4.1 C5.2 C6.1 C9.1 C10.1 C11.2 C12.2 C13.1 C14.1 C15.1 C16.1 C17.1 C18.1 C19.1 C20.2 C21.2 C22.2 C23.2 C24.2 C25.2 C26.1 C27.2 C28.2 C29.1 C30.2 C31.1 C32.1 C33.1 C34.1 C35.1 C36.1 C37.2 CARD1.6(VSS) CARD1.9(SW) CARD1.10(SHELL) H1.6 H1.15 H1.16 H1.17 H1.18 H1.20 H1.26 H1.28 H1.35 H1.36 J1.8(CHS GND) LED1.1(K) LED3.1(K) R3.1 R8.1 R11.2 R12.1 R17.1 R18.1 R36.1 RUN.2 SW1.2 U1.2(GND) U2.3(GND) U3.19(TESTEN) U3.57(GND) U4.3(AGND) U4.9(AGND) U4.14(AGND) U4.16(AGND) U4.19(AGND) U4.29(GND) U4.48(AGND) U5.4(GND) U5.9(EP) USB1.1(GND) USB1.12(GND) USB1.13(SHELL) USB1.14(SHELL) USB2.1(GND) USB2.12(GND) USB2.13(SHELL) USB2.14(SHELL) X1.2 X1.4 X2.2 X2.4
VBUS: F1.1 H1.1 H1.2 H1.3 H1.4 USB1.2(VBUS) USB1.11(VBUS) USB2.2(VBUS) USB2.11(VBUS)
ACT: R22.1 U4.27(ACTLED)
ADC_VREF: H1.5 R20.1 R23.2
D+: R2.1 USB1.6(DP1) USB1.8(DP2)
D+2: U2.1(UD+) USB2.6(DP1) USB2.8(DP2)
D-: R1.1 USB1.5(DN2) USB1.7(DN1)
D-2: U2.2(UD-) USB2.5(DN2) USB2.7(DN1)
GPIO0: R13.1 R15.2 U3.2(GPIO0)
GPIO1: R14.1 R16.2 U3.3(GPIO1)
GPIO2: H1.39 U3.4(GPIO2)
GPIO3: H1.40 U3.5(GPIO3)
GPIO4: H1.37 U3.6(GPIO4)
GPIO5: H1.38 U3.7(GPIO5)
GPIO6: H1.33 U3.8(GPIO6)
GPIO7: H1.34 U3.9(GPIO7)
GPIO8: H1.31 U3.11(GPIO8)
GPIO9: H1.32 U3.12(GPIO9)
GPIO10: CARD1.5(CLK) R7.2 U3.13(GPIO10)
GPIO11: CARD1.3(CMD) R6.2 U3.14(GPIO11)
GPIO12: CARD1.7(DAT0) R10.2 U3.15(GPIO12)
GPIO13: CARD1.2(CD/DAT3) R5.2 U3.16(GPIO13)
GPIO14: H1.29 U3.17(GPIO14)
GPIO15: H1.30 U3.18(GPIO15)
GPIO16: U3.27(GPIO16) U4.34(MISO)
GPIO17: R28.1 U3.28(GPIO17) U4.32(SCSn)
GPIO18: U3.29(GPIO18) U4.33(SCLK)
GPIO19: U3.30(GPIO19) U4.35(MOSI)
GPIO20: R24.1 U3.31(GPIO20) U4.37(RSTn)
GPIO21: R27.1 U3.32(GPIO21) U4.36(INTn)
GPIO22: H1.14 U3.34(GPIO22)
GPIO23: H1.13 U3.35(GPIO23)
GPIO24: H1.12 U3.36(GPIO24)
GPIO25: H1.11 R35.1 U3.37(GPIO25)
GPIO26: H1.10 U3.38(GPIO26_ADC0)
GPIO27: H1.9 U3.39(GPIO27_ADC1)
GPIO28: H1.8 U3.40(GPIO28_ADC2)
GPIO29: H1.7 U3.41(GPIO29_ADC3)
LINK: R21.1 U4.25(LINKLED)
QSPI_SCLK: U3.52(QSPI_SCLK) U5.6(CLK)
QSPI_SD0: U3.53(QSPI_SD0) U5.5(DI/IO0)
QSPI_SD1: U3.55(QSPI_SD1) U5.2(DO/IO1)
QSPI_SD2: U3.54(QSPI_SD2) U5.3(#WP/IO2)
QSPI_SD3: U3.51(QSPI_SD3) U5.7(#HOLD-OR-#REST/IO3)
QSPI_SS_N: R40.1 R41.1 U3.56(QSPI_SS) U5.1(#CS)
RCT: C6.2 J1.5 R29.2 R30.2
RUN: H1.19 R39.1 U3.26(RUN)
RXN: C7.1 R30.1 R33.1
RXP: C8.1 R29.1 R34.2
SWCLK: H1.27 U3.24(SWCLK)
SWDIO: H1.25 U3.25(SWD)
TXN: J1.2(TD-) R26.1 R31.1
TXP: J1.1(TD+) R25.1 R32.2
USB+: R2.2 U3.47(USB_DP)
USB-: R1.2 U3.46(USB_DM)
XIN: C31.2 U3.20(XIN) X1.1(OSC1)
XOUT: C32.2 U3.21(XOUT) X1.3(OSC2)
$1N272: C26.2 J1.SH1 J1.SH2
$1N523: R3.2 USB1.4(CC1)
$1N532: R8.2 USB1.10(CC2)
$1N2010: R9.1 U1.3(EN)
$1N3119: LED3.2(A) R35.2
$1N3535: R41.2 SW1.1
$1N4654: R39.2 RUN.1
$1N8144: C5.1 U2.10(V3)
$1N8171: LED2.3(-) R11.1
$1N8173: R15.1 U2.9(RXD)
$1N8174: R16.1 U2.8(TXD)
$1N8175: LED2.4(-) R14.2
$1N8176: LED2.1(-) R13.2
$1N8597: R12.2 USB2.4(CC1)
$1N8606: R17.2 USB2.10(CC2)
$1N16354: C7.2 J1.6(RD-)
$1N16357: C8.2 J1.3(RD+)
$1N16389: J1.10 R21.2
$1N16464: J1.11 R22.2
$1N16754: C10.2 J1.4 R19.2
$1N16860: R36.2 U4.10(EXRES1)
$1N16990: C34.2 U4.20(TOCAP)
$1N16993: C36.2 U4.22(1V2O)
$1N21081: R18.2 U2.6(TNOW)
$1N41377: LED1.2(A) R4.1
$1N41485: C29.2 R23.1 U3.43(ADC_AVDD)
$1N55884: C35.2 R37.1 U4.30(XI/CLKIN) X2.1(OSC1)
$1N55913: R37.2 R38.2 U4.31(XO)
$1N55914: C33.2 R38.1 X2.3(OSC2)
$1N70865: R33.2 U4.5(RXN)
$1N70868: R34.1 U4.6(RXP)
$1N70953: R31.2 U4.1(TXN)
$1N70956: R32.1 U4.2(TXP)

Not connected (* = marked no-connect by the designer): CARD1 1(DAT2)* 8(DAT1)*; J1 7(NC)*; U1 4(NC)*; U2 4(RTS#)* 5(CTS#)*; U4 7(DNC)* 12(NC)* 13(NC)* 18(VBG)* 23(RSVD)* 24(SPDLED)* 26(DUPLED)* 38(RSVD)* 39(RSVD)* 40(RSVD)* 41(RSVD)* 42(RSVD)* 46(NC)* 47(NC)*; USB1 3(SBU2)* 9(SBU1)*; USB2 3(SBU2)* 9(SBU1)*

## Notes on the sheet
- 2025/3/1:V2.0 修改V1部分不合理处
